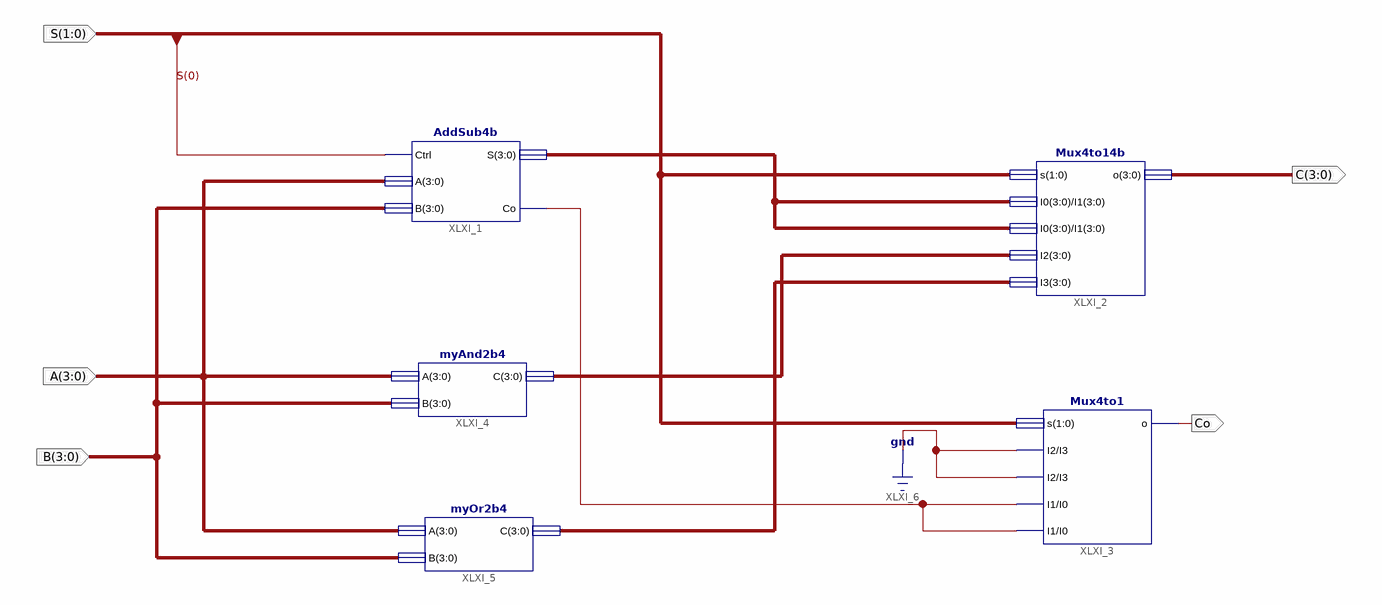
[diagram p0: schematic sheet 1]
// Xilinx ISE schematic myALU.sch (kintex7) as structural Verilog: 5 symbols, 5 ports
module myALU (
  input  [3:0] A,
  input  [3:0] B,
  input  [1:0] S,
  output [3:0] C,
  output Co
);

  wire XLXN_17;
  wire [3:0] XLXN_13, XLXN_20, XLXN_21;

  AddSub4b XLXI_1 (.Ctrl(S[0]), .A(A), .B(B), .S(XLXN_13), .Co(XLXN_17));
  Mux4to14b XLXI_2 (.s(S), .I0(XLXN_13), .I1(XLXN_13), .I2(XLXN_20), .I3(XLXN_21), .o(C));
  Mux4to1 XLXI_3 (.s(S), .I2(1'b0), .I3(1'b0), .I1(XLXN_17), .I0(XLXN_17), .o(Co));
  myAnd2b4 XLXI_4 (.A(A), .B(B), .C(XLXN_20));
  myOr2b4 XLXI_5 (.A(A), .B(B), .C(XLXN_21));
endmodule
